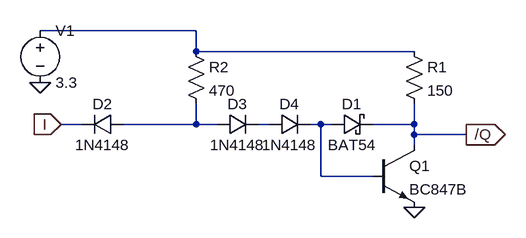
[diagram p0: schematic INV1.asc]
INV1.asc, the LTspice schematic file:
Version 4
SHEET 1 880 680
WIRE 176 -16 -64 -16
WIRE 176 16 176 -16
WIRE 512 16 176 16
WIRE 0 128 -32 128
WIRE 176 128 176 96
WIRE 176 128 64 128
WIRE 208 128 176 128
WIRE 288 128 272 128
WIRE 368 128 352 128
WIRE 384 128 368 128
WIRE 512 128 512 96
WIRE 512 128 448 128
WIRE 512 144 512 128
WIRE 592 144 512 144
WIRE 512 160 512 144
WIRE 368 208 368 128
WIRE 448 208 368 208
FLAG 512 256 0
FLAG 592 144 /Q
IOPIN 592 144 Out
FLAG -32 128 I
IOPIN -32 128 In
FLAG -64 64 0
SYMBOL npn 448 160 R0
SYMATTR InstName Q1
SYMATTR Value BC847B
SYMBOL res 496 0 R0
SYMATTR InstName R1
SYMATTR Value 150
SYMBOL res 160 0 R0
SYMATTR InstName R2
SYMATTR Value 470
SYMBOL schottky 384 144 R270
WINDOW 0 32 32 VTop 2
WINDOW 3 0 32 VBottom 2
SYMATTR InstName D1
SYMATTR Value BAT54
SYMATTR Description Diode
SYMATTR Type diode
SYMBOL diode 64 112 R90
WINDOW 0 0 32 VBottom 2
WINDOW 3 32 32 VTop 2
SYMATTR InstName D2
SYMATTR Value 1N4148
SYMBOL diode 208 112 M90
WINDOW 0 0 32 VBottom 2
WINDOW 3 32 32 VTop 2
SYMATTR InstName D3
SYMATTR Value 1N4148
SYMBOL diode 288 112 M90
WINDOW 0 0 32 VBottom 2
WINDOW 3 32 32 VTop 2
SYMATTR InstName D4
SYMATTR Value 1N4148
SYMBOL voltage -64 -32 R0
SYMATTR InstName V1
SYMATTR Value 3.3

The netlist it stands for:
* INV1.asc
Q1 /Q N004 0 0 BC847B
R1 N001 /Q 150
R2 N001 N002 470
D1 N004 /Q BAT54
D2 N002 I 1N4148
D3 N002 N003 1N4148
D4 N003 N004 1N4148
V1 N001 0 3.3
.model D D
.lib standard.dio
.model NPN NPN
.model PNP PNP
.lib standard.bjt
.backanno
.end